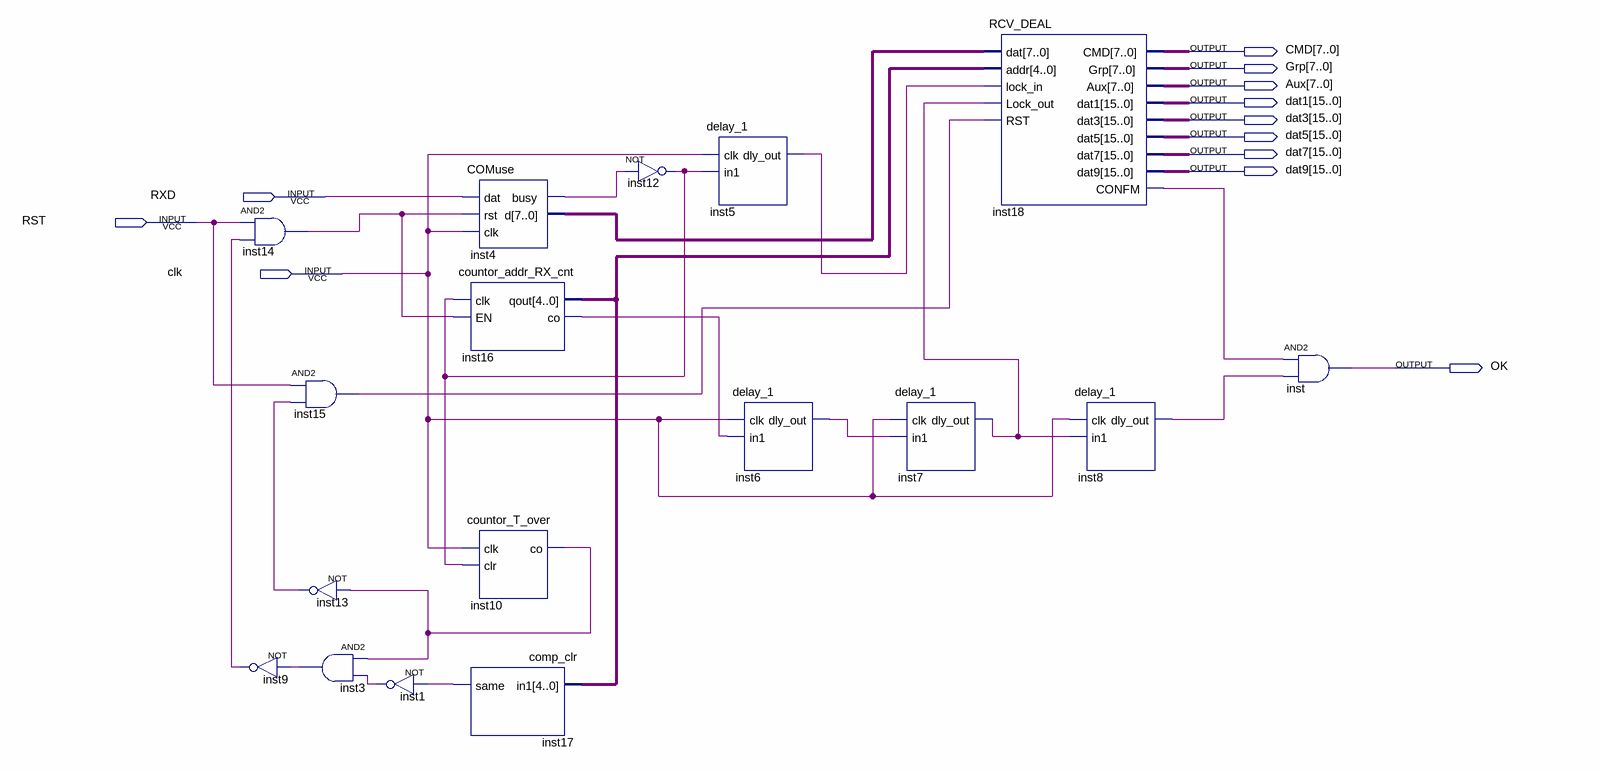
[diagram p0: schematic sheet]
// Quartus schematic RCV_FROM_PC.bdf as structural Verilog: 17 symbols, 12 pins
module RCV_FROM_PC (
  input  RXD,
  input  RST,
  input  clk,
  output [7:0] CMD,
  output [7:0] Grp,
  output [7:0] Aux,
  output [15:0] dat1,
  output [15:0] dat3,
  output [15:0] dat5,
  output [15:0] dat7,
  output [15:0] dat9,
  output OK
);

  wire inst1_out, inst3_out, inst4_busy, inst5_dly_out, inst6_dly_out, inst7_dly_out, inst8_dly_out,
       inst9_out, inst10_co, inst12_out, inst13_out, inst14_out, inst15_out, inst16_co, inst17_same,
       inst18_confm;
  wire [4:0] inst16_qout;
  wire [7:0] inst4_d;

  and inst14 (inst14_out, RST, inst9_out);
  and inst15 (inst15_out, RST, inst13_out);
  not inst9 (inst9_out, inst3_out);
  not inst13 (inst13_out, inst10_co);
  and inst3 (inst3_out, inst10_co, inst1_out);
  not inst1 (inst1_out, inst17_same);
  COMuse inst4 (.dat(RXD), .rst(inst14_out), .clk(clk), .busy(inst4_busy), .d(inst4_d));
  countor_addr_RX_cnt inst16 (.clk(inst12_out), .EN(inst14_out), .qout(inst16_qout), .co(inst16_co));
  countor_T_over inst10 (.clk(clk), .clr(inst12_out), .co(inst10_co));
  comp_clr inst17 (.in1(inst16_qout), .same(inst17_same));
  not inst12 (inst12_out, inst4_busy);
  delay_1 inst5 (.clk(clk), .in1(inst12_out), .dly_out(inst5_dly_out));
  delay_1 inst6 (.clk(clk), .in1(inst16_co), .dly_out(inst6_dly_out));
  delay_1 inst7 (.clk(clk), .in1(inst6_dly_out), .dly_out(inst7_dly_out));
  RCV_DEAL inst18 (
    .dat(inst4_d), .addr(inst16_qout), .lock_in(inst5_dly_out), .Lock_out(inst7_dly_out), .RST(inst15_out),
    .CMD(CMD), .Grp(Grp), .Aux(Aux), .dat1(dat1), .dat3(dat3), .dat5(dat5), .dat7(dat7), .dat9(dat9),
    .CONFM(inst18_confm));
  delay_1 inst8 (.clk(clk), .in1(inst7_dly_out), .dly_out(inst8_dly_out));
  and inst (OK, inst18_confm, inst8_dly_out);
endmodule
